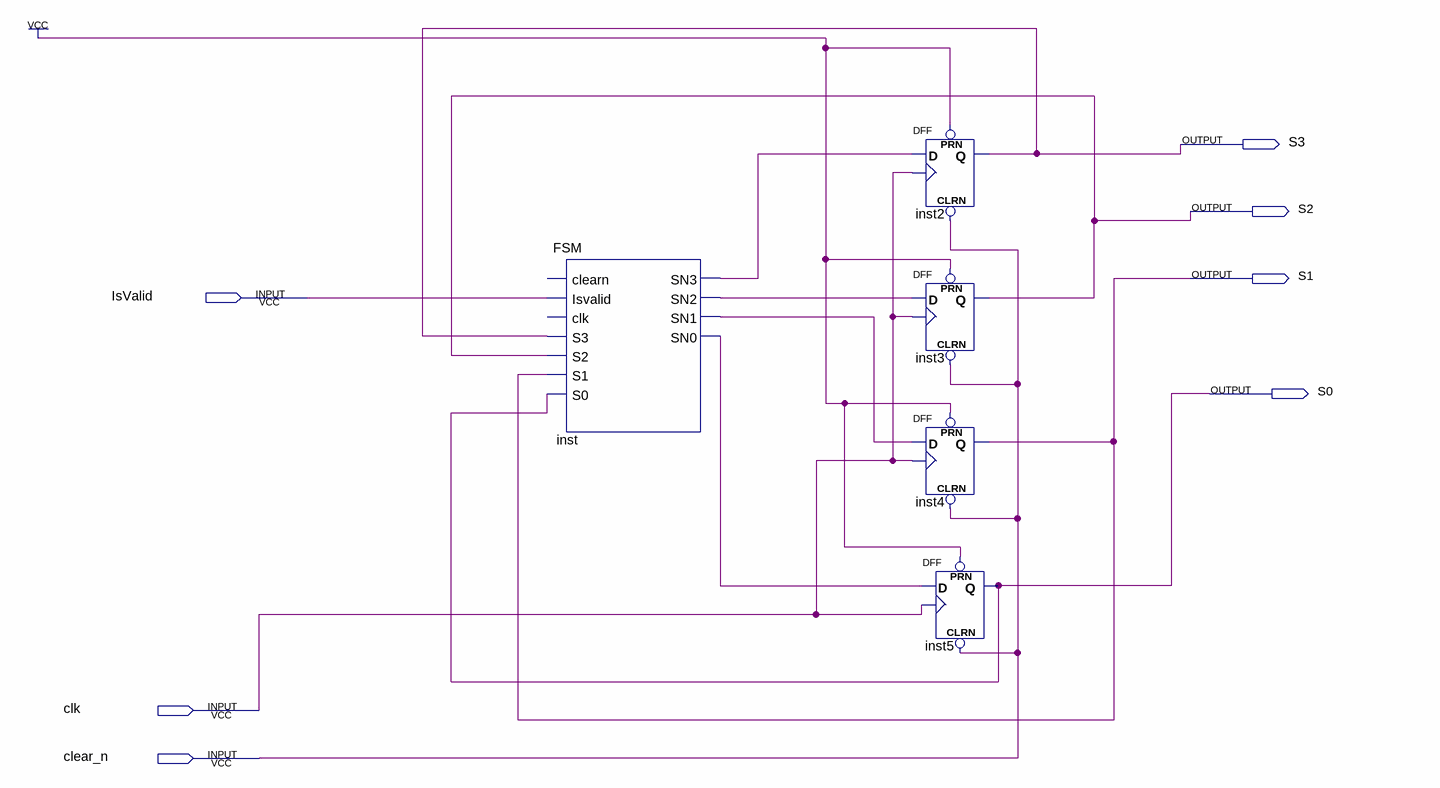
[diagram p0: schematic sheet]
// Quartus schematic FSM_ordercheck.bdf as structural Verilog: 5 symbols, 7 pins
module FSM_ordercheck (
  input  IsValid,
  input  clk,
  input  clear_n,
  output S3,
  output S2,
  output S1,
  output S0
);

  wire inst_sn0, inst_sn1, inst_sn2, inst_sn3;

  FSM inst (
    .Isvalid(IsValid), .S3(S3), .S2(S2), .S1(S1), .S0(S0), .SN3(inst_sn3), .SN2(inst_sn2), .SN1(inst_sn1),
    .SN0(inst_sn0));  // open: clearn, clk
  DFF inst2 (.CLRN(clear_n), .CLK(clk), .D(inst_sn3), .PRN(1'b1), .Q(S3));
  DFF inst3 (.CLRN(clear_n), .CLK(clk), .D(inst_sn2), .PRN(1'b1), .Q(S2));
  DFF inst4 (.CLRN(clear_n), .CLK(clk), .D(inst_sn1), .PRN(1'b1), .Q(S1));
  DFF inst5 (.CLRN(clear_n), .CLK(clk), .D(inst_sn0), .PRN(1'b1), .Q(S0));
endmodule
